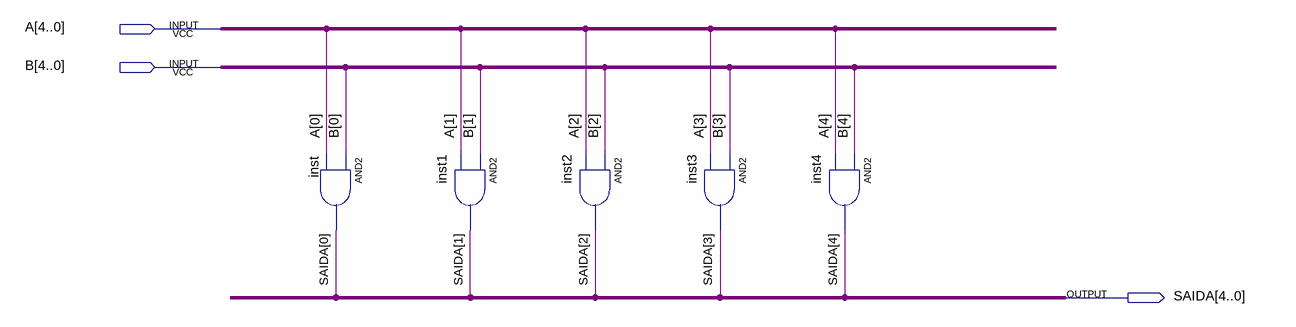
[diagram p0: schematic sheet]
// Quartus schematic AND.bdf as structural Verilog: 5 symbols, 3 pins
module AND (
  input  [4:0] A,
  input  [4:0] B,
  output [4:0] SAIDA
);

  and inst (SAIDA[0], B[0], A[0]);
  and inst1 (SAIDA[1], B[1], A[1]);
  and inst2 (SAIDA[2], B[2], A[2]);
  and inst3 (SAIDA[3], B[3], A[3]);
  and inst4 (SAIDA[4], B[4], A[4]);
endmodule
